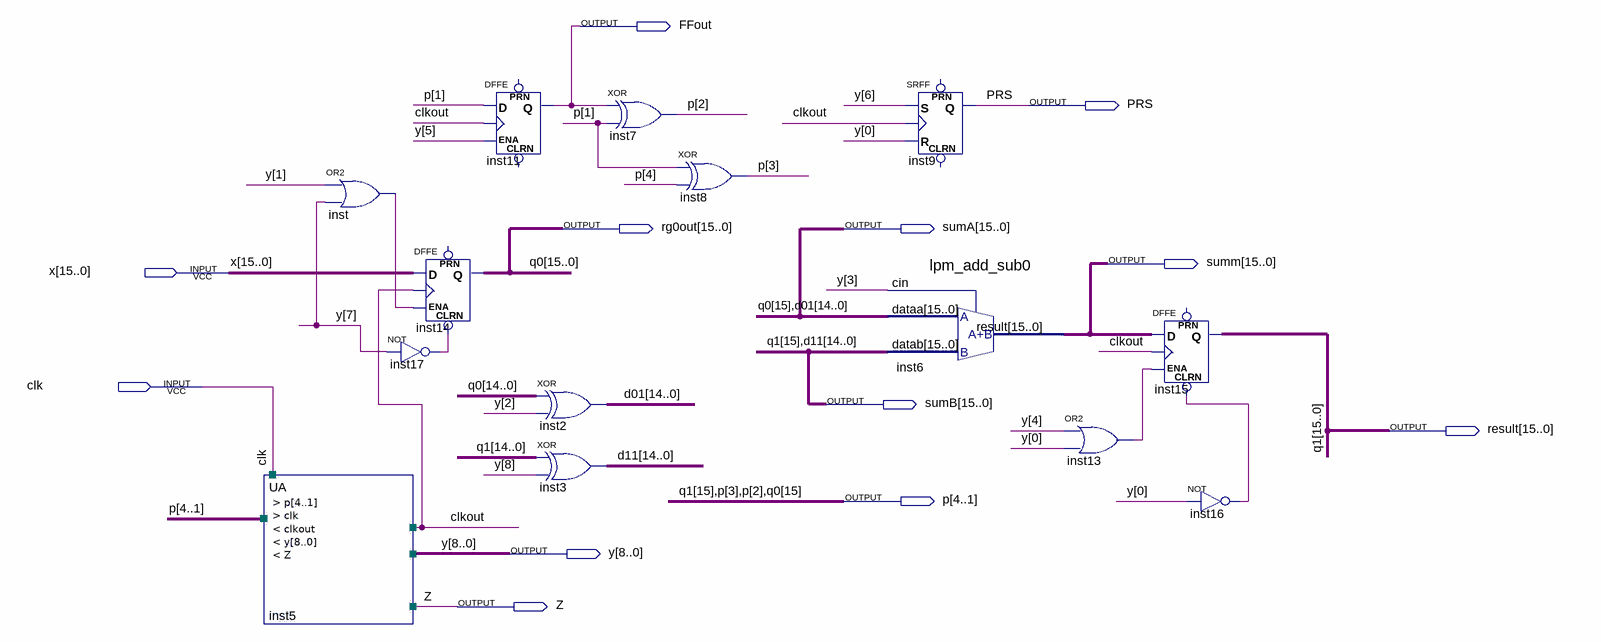
[diagram p0: schematic sheet]
// Quartus schematic operatio.bdf as structural Verilog: 14 symbols, 12 pins
module operatio (
  input  [15:0] x,
  input  clk,
  output FFout,
  output PRS,
  output [15:0] rg0out,
  output [15:0] sumA,
  output [15:0] summ,
  output [15:0] sumB,
  output [15:0] result,
  output [4:1] p,
  output [8:0] y,
  output Z
);

  wire clkout, inst13_out, inst16_out, inst17_out, inst_out;

  UA inst5 (.p(p), .clk(clk), .clkout(clkout), .y(y), .Z(Z));
  or inst (inst_out, y[1], y[7]);
  DFFE inst14[15:0] (.CLRN(inst17_out), .D(x), .CLK(clkout), .ENA(inst_out), .Q({p[1], rg0out[14:0]}));  // open: PRN
  not inst17 (inst17_out, y[7]);
  DFFE inst11 (.D(p[1]), .CLK(clkout), .ENA(y[5]), .Q(FFout));  // open: PRN, CLRN
  assign sumA[14:0] = rg0out[14:0] ^ {15{y[2]}};  // XOR inst2, 15 bits wide
  assign sumB[14:0] = result[14:0] ^ {15{y[8]}};  // XOR inst3, 15 bits wide
  xor inst7 (p[2], FFout, p[1]);
  xor inst8 (p[3], p[1], p[4]);
  SRFF inst9 (.S(y[6]), .R(y[0]), .CLK(clkout), .Q(PRS));  // open: PRN, CLRN
  lpm_add_sub0 inst6 (.dataa({p[1], sumA[14:0]}), .datab({p[4], sumB[14:0]}), .cin(y[3]), .result(summ));
  or inst13 (inst13_out, y[4], y[0]);
  DFFE inst15[15:0] (
    .CLRN(inst16_out), .D(summ), .CLK(clkout), .ENA(inst13_out), .Q({p[4], result[14:0]}));  // open: PRN
  not inst16 (inst16_out, y[0]);

  assign result[15] = p[4];
  assign rg0out[15] = p[1];
  assign sumA[15] = p[1];
  assign sumB[15] = p[4];

  // Other names for the same wires on the sheet: q1[15:0] = {p[4], result[14:0]}; q0[15:0] = {p[1], rg0out[14:0]};
  //   d01[14:0] = sumA[14:0]; d11[14:0] = sumB[14:0]
endmodule
